# EasyEDA Pro project PicoDMX Line Driver.eprj

# Schematic Schematic1
Board Name: Line Driver; Create Date: 2025-05-27; Page Name: P1; Project Name: PicoDMX Line Driver; Schematic Name: Schematic1; Update Date: 2025-05-30; Company: Marcus Birkin; Drawn: Marcus; Page Size: A5; Version: 1
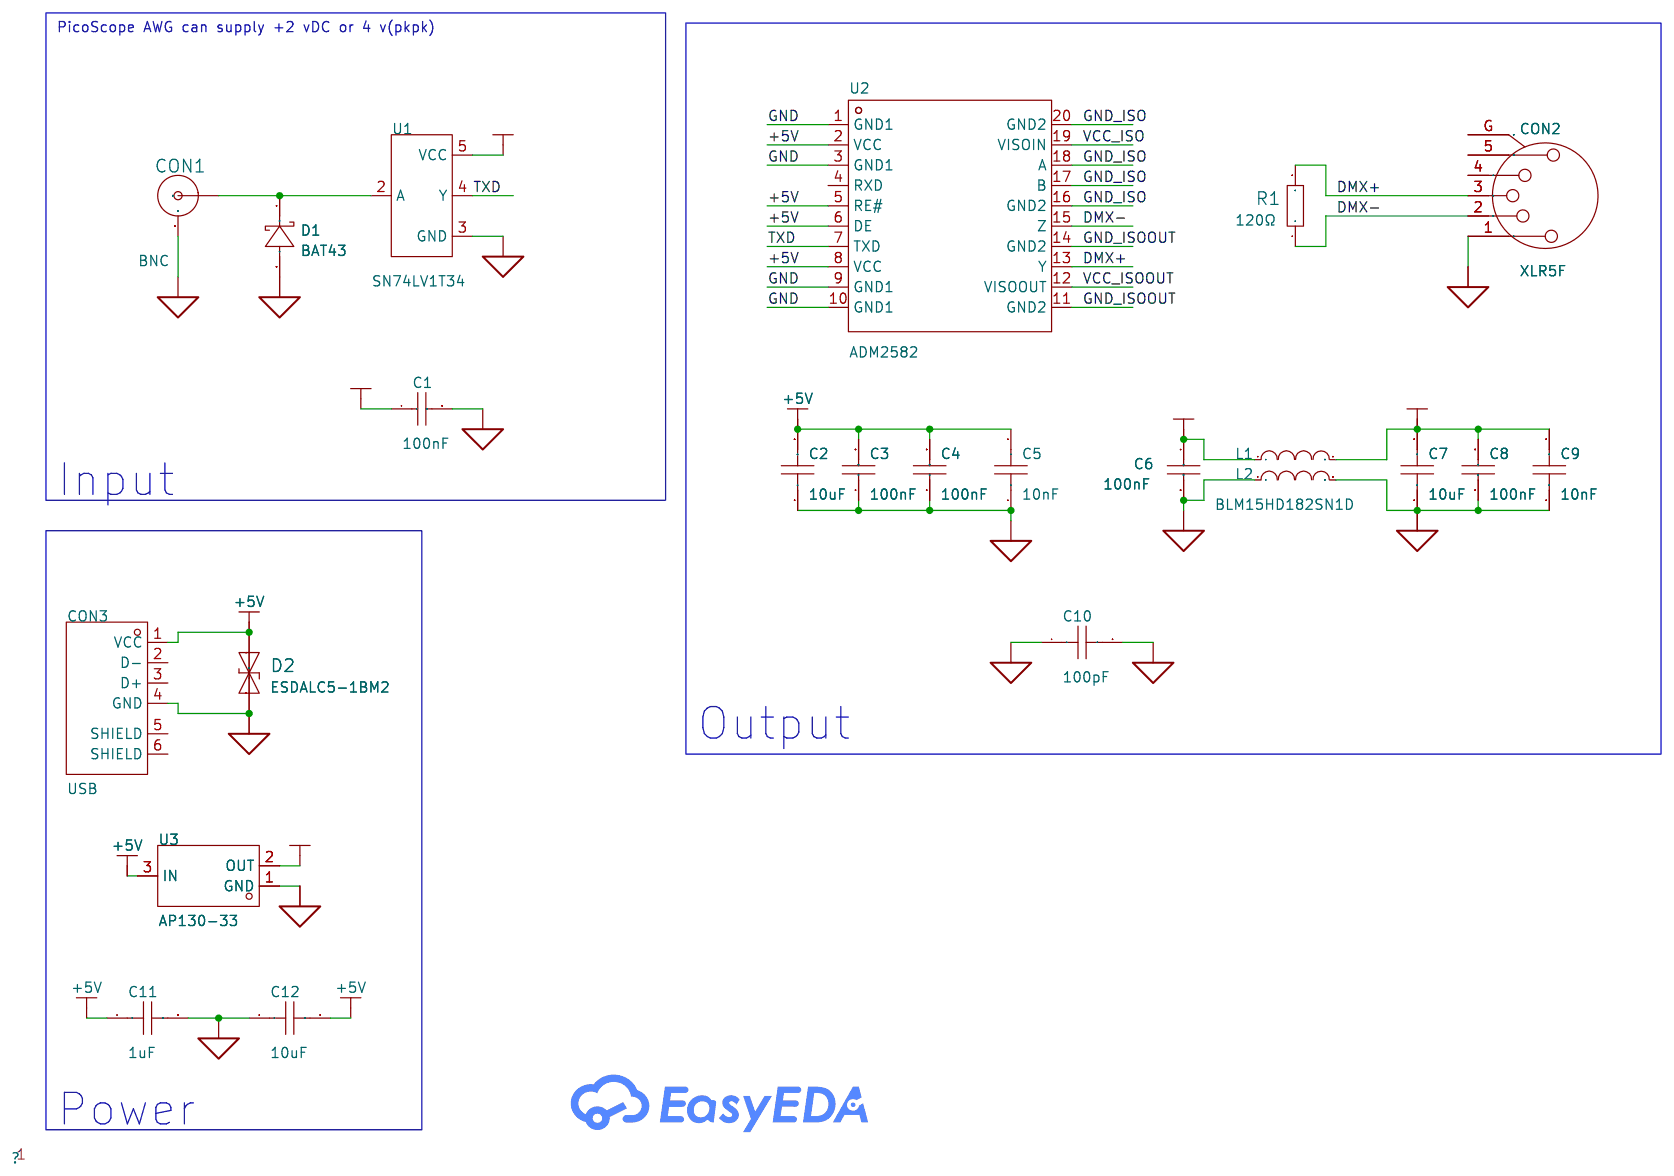
[diagram p0: schematic sheet]

## Parts
C1  100nF  [C0603]
C2  10uF  [C0805]
C3  100nF  [C0603]
C4  100nF  [C0603]
C5  10nF  [C0603]
C6  100nF  [C0603]
C7  10uF  [C0805]
C8  100nF  [C0603]
C9  10nF  [C0603]
C10  100pF  [C1812]
C11  1uF  [C0603]
C12  10uF  [C0805]
CON1  BNC  [ANT-TH_KH-BNC50-3511]
CON2  XLR5F  [CONN-TH_NC5FAH]
CON3  USB  [USB-B-TH_AMPHENOL_61729-0010BLF]
D1  BAT43  [SOD-323_L1.7-W1.3-LS2.6-RD-1]
D2  ESDALC5-1BM2  [SOD-882_L1.0-W0.6-BI-1]
L1  BLM15HD182SN1D  [L0402]
L2  BLM15HD182SN1D  [L0402]
R1  120Ω  [R0603]
U1  SN74LV1T34  [SOT-23-5_L2.9-W1.6-P0.95-LS2.8-BR]
U2  ADM2582  [SOIC-20_L13.0-W7.6-P1.27-LS10.3-BL]
U3  AP130-33  [SC-59-3_L2.9-W1.5-P0.95-LS2.5-BR]

## Library data of the parts
C1 C3 C4 C6 C8 = C0603C104K5RACTU: LCSC Part Name: 100nF ±10% 50V; Supplier Part: C127833; Manufacturer: KEMET(基美); Supplier Footprint: 0603; JLCPCB Part Class: Extended Part; Datasheet: https://atta.szlcsc.com/upload/public/pdf/source/20180326/C129691_620535B46A8EA2FB2DC0739E6AA6F36A.pdf; Supplier: LCSC; Tolerance: ±10%; Voltage Rating: 50V; Temperature Coefficient: X7R
C2 C7 C12 = C0805C106K8PACTU: LCSC Part Name: 10uF ±10% 10V; Supplier Part: C2167673; Manufacturer: KEMET(基美); Supplier Footprint: 0805; JLCPCB Part Class: Extended Part; Datasheet: https://atta.szlcsc.com/upload/public/pdf/source/20210601/F69F25D6FEA5EB3D7C122B835EA50B80.pdf; Supplier: LCSC; Tolerance: ±10%
C5 C9 = C0603C103J5RAC7867: LCSC Part Name: 10nF ±5% 50V; Supplier Part: C141070; Manufacturer: KEMET(基美); Supplier Footprint: 0603; JLCPCB Part Class: Extended Part; Datasheet: https://atta.szlcsc.com/upload/public/pdf/source/20180418/C190790_D7C76C15864DAD2D05332FBDBFF02F59.pdf; Supplier: LCSC; Tolerance: ±5%
C10 = C4532C0G3F101K160KA: LCSC Part Name: 100pF ±10% 3kV; Supplier Part: C2167913; Manufacturer: TDK; Supplier Footprint: 1812; JLCPCB Part Class: Extended Part; Datasheet: https://atta.szlcsc.com/upload/public/pdf/source/20210430/6D9A36C8C5D95BF03488684137B0D508.pdf; Supplier: LCSC; Tolerance: ±10%
C11 = C0603C105K8PAC7867: Capacitance: Tolerance:±10% Tolerance:±10% Voltage Rated: Temperature Coefficient:; LCSC Part Name: 1uF ±10% 10V; Supplier Part: C599658; Manufacturer: KEMET(基美); Supplier Footprint: 0603; JLCPCB Part Class: Extended Part; Datasheet: https://atta.szlcsc.com/upload/public/pdf/source/20200618/C599658_D69DC6DD034FFAE34545B4DB2250202B.pdf; Supplier: LCSC; Tolerance: ±10%
CON1 = KH-BNC50-3511: Connector Type:板端 Interface Type:内孔 Number of Ports:1 Interface Diameter:9.5mm Interface Length/Height:- Frequency-Max:3GHz RF Series:BNC Impedance:50Ω Style:弯头 Operating Temperature Range:-55℃~+155℃ Operating Temperature Range:-55℃~+155℃; LCSC Part Name: BNC 内孔 弯头; Supplier Part: C2837587; Manufacturer: kinghelm(金航标); Supplier Footprint: 插件; JLCPCB Part Class: Extended Part; Datasheet: https://atta.szlcsc.com/upload/public/pdf/source/20221123/AFF24A942BB0EF6B7776F494013BE75C.pdf; Supplier: LCSC; Connector Type: 板端; Interface Type: 内孔; Number of Ports: 1; Interface Diameter: 9.5mm; Frequency-Max: 3GHz; Impedance: 50Ω; Style: 弯头; Operating Temperature Range: -55℃~+155℃
CON2 = NC5FAH: Supplier Part: C368501; Manufacturer: NEUTRIK(优曲克); Supplier Footprint: 插件; JLCPCB Part Class: Extended Part; Datasheet: https://atta.szlcsc.com/upload/public/pdf/source/20191012/C368501_48BF0D1DB9A038BF0C77086A8AE98FA7.pdf; Supplier: LCSC
CON3 = 61729-1011BLF: LCSC Part Name: Type-B 母 弯插; Supplier Part: C254704; Manufacturer: Amphenol; Supplier Footprint: 插件; JLCPCB Part Class: Extended Part; Datasheet: https://atta.szlcsc.com/upload/public/pdf/source/20220215/3240002EE1DEE46B009290BA915BD368.pdf; Supplier: LCSC; Connector Type: Type-B; Standard: USB 2.0; Gender: Female; Mounting Style: Bend insert; Number of Contacts: 4P; Number of Ports: 1; Operating Temperature Range: -55℃~+85℃
D1 = BAT43WS_C7502693: LCSC Part Name: 电压:30V 电流:200mA; Supplier Part: C7502693; Manufacturer: 宏迦橙; Supplier Footprint: SOD-323; JLCPCB Part Class: Extended Part; Datasheet: https://atta.szlcsc.com/upload/public/pdf/source/20230828/C7BEF188DCC55075738098E602AF8932.pdf; Supplier: LCSC; Diode Configuration: Single; Forward Voltage (Vf@If): 1V@0.2A; Reverse Voltage (Vr): 30V; Average Rectified Current (Io): 200mA; Reverse Leakage Current (Ir): 500nA; Peak forward surge current: 4A
D2 = ESDALC5-1BM2: Supplier Part: C1974505; Manufacturer: ST(意法半导体); Supplier Footprint: SOD-882; JLCPCB Part Class: Extended Part; Datasheet: https://atta.szlcsc.com/upload/public/pdf/source/20210701/73BC0DDABB7475F0CD853E221D79507A.pdf; Supplier: LCSC; Reverse Stand-Off Voltage (Vrwm): 5V; Maximum Clamping Voltage: 5.8V; Peak Pulse Power Dissipation (Ppp)@10/1000us: 150W; Breakdown Voltage: 5.8V; Operating Temperature: -55℃~+150℃@(Tj); Type: ESD
L1 L2 = BLM15HD182SN1D: LCSC Part Name: 单路 0402磁珠 阻抗1.8kΩ@100MHz; Supplier Part: C76888; Manufacturer: muRata(村田); Supplier Footprint: 0402; JLCPCB Part Class: Extended Part; Datasheet: https://atta.szlcsc.com/upload/public/pdf/source/20180326/C88968_F3BA34B77F909E6389EF9B963D60C071.pdf; Supplier: LCSC; Impedance @ Frequency: 1.8kΩ@100MHz; Tolerance: ±25%; DC Resistance: 2.2Ω; Current Rating: 200mA; Circuits: 1
R1 = 0603WAF1200T5E: LCSC Part Name: 120Ω ±1% 100mW 厚膜电阻; Supplier Part: C22787; Manufacturer: UNI-ROYAL(厚声); Supplier Footprint: 0603; JLCPCB Part Class: Basic Part; Datasheet: https://atta.szlcsc.com/upload/public/pdf/source/20200306/C422600_1E6D84923E4A46A82E41ADD87F860B5C.pdf; Supplier: LCSC; Type: Thick Film Resistors; Tolerance: ±1%; Temperature Coefficient: ±100ppm/℃; Operating Temperature Range: -55℃~+155℃
U1 = SN74LV1T34DBVR: Input type:- output type:- Voltage - Supply:1.6V~5.5V Voltage - Supply:1.6V~5.5V Number of Elements:1 Number of Bits per Element:1 Current - Output Low(IOL):8mA Current - Output High(IOH):8mA Logic Family:74LV Operating Temperature:-40℃~+125℃ Operating Te; Supplier Part: C100024; Manufacturer: TI(德州仪器); Supplier Footprint: SOT-23-5; JLCPCB Part Class: Extended Part; Datasheet: https://www.ti.com/cn/lit/gpn/sn74lv1t34; Supplier: LCSC; Voltage - Supply: 1.6V~5.5V; Number of Elements: 1; Number of Bits per Element: 1; Current - Output Low(IOL): 8mA; Current - Output High(IOH): 8mA; Logic Family: 74LV; Operating Temperature: -40℃~+125℃
U2 = ADM2582EBRWZ-REEL7: LCSC Part Name: 2.5 kV信号和电源隔离、±15 kV ESD保护、全/半双工RS-485收发器(16Mbps); Supplier Part: C39494; Manufacturer: ADI(亚德诺); Supplier Footprint: SOIC-20-300mil; JLCPCB Part Class: Extended Part; Datasheet: https://atta.szlcsc.com/upload/public/pdf/source/20220721/6BB53C864ED93F5D36B0DC291BEFEF02.pdf; Supplier: LCSC; Communication Mode: Full-duplex；Half-Duplex; Voltage - Supply: 3.3V；5V; Isolation Voltage(Vrms): 2500; CMTI(kV/us): 25kV/us; Operating Temperature: -40℃~+85℃
U3 = AP130-33RG-7: LCSC Part Name: 300mA低压差线性稳压器; Supplier Part: C156319; Manufacturer: DIODES(美台); Supplier Footprint: SC-59R; JLCPCB Part Class: Extended Part; Datasheet: https://atta.szlcsc.com/upload/public/pdf/source/20180502/C211383_3A64D916EE20C5FB1434B0F452C39E5F.pdf; Supplier: LCSC; Output Type: Fixed; Maximum Input Voltage: 5.5V; Output Voltage: 3.3V; Output Current: 300mA; Power Supply Rejection Ratio (PSRR): 58dB@(100Hz); Dropout Voltage: 500mV@(300mA); standby current: 100uA; Feature: Thermal Protection(TSD)；Overcurrent Protection(OCP); Operating Temperature: -40℃~+85℃@(Ta); Output Polarity: Positive electrode; Number of Outputs: 1

## Nets
+3V3: C1.1 U1.5(VCC) U3.2(OUT)
+5V: C2.2 C3.2 C4.2 C5.2 C11.1 C12.2 CON3.1(VCC) D2.1(K) U2.2(VCC) U2.5(RE#) U2.6(DE) U2.8(VCC) U3.3(IN)
GND: C1.2 C2.1 C3.1 C4.1 C5.1 C10.1 C11.2 C12.1 CON1.2 CON3.4(GND) D1.2(A) D2.2(A) U1.3(GND) U2.1(GND1) U2.3(GND1) U2.9(GND1) U2.10(GND1) U3.1(GND)
GND_ISO: C7.1 C8.1 C9.1 CON2.1 L2.2 U2.16(GND2) U2.17(B) U2.18(A) U2.20(GND2)
GND_ISOOUT: C6.2 C10.2 L2.1 U2.11(GND2) U2.14(GND2)
VCC_ISO: C7.2 C8.2 C9.2 L1.2 U2.19(VISOIN)
VCC_ISOOUT: C6.1 L1.1 U2.12(VISOOUT)
DMX+: CON2.3 R1.2 U2.13(Y)
DMX-: CON2.2 R1.1 U2.15(Z)
TXD: U1.4(Y) U2.7(TXD)
$1N303: CON1.1(OUT) D1.1(K) U1.2(A)

Not connected (* = marked no-connect by the designer): CON2 4 5 G; CON3 2(D-) 3(D+) 5(SHIELD) 6(SHIELD); U2 4(RXD)

## Notes on the sheet
- PicoScope AWG can supply +2 vDC or 4 v(pkpk)
- Input
- Output
- Power

# Board PCB1
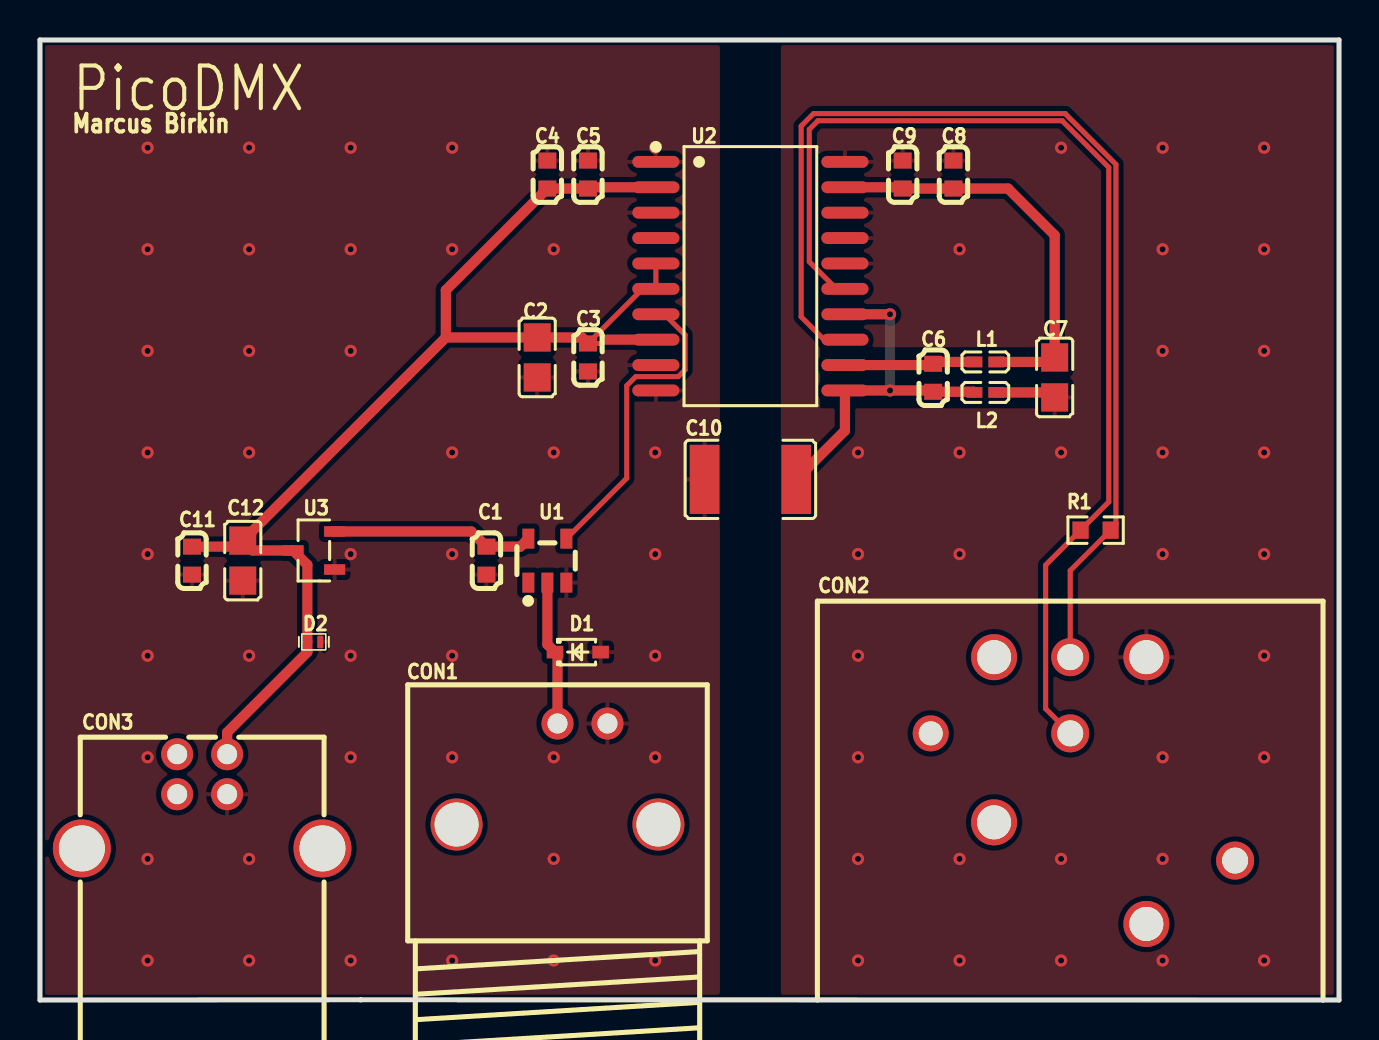
[diagram p1: board, top side]
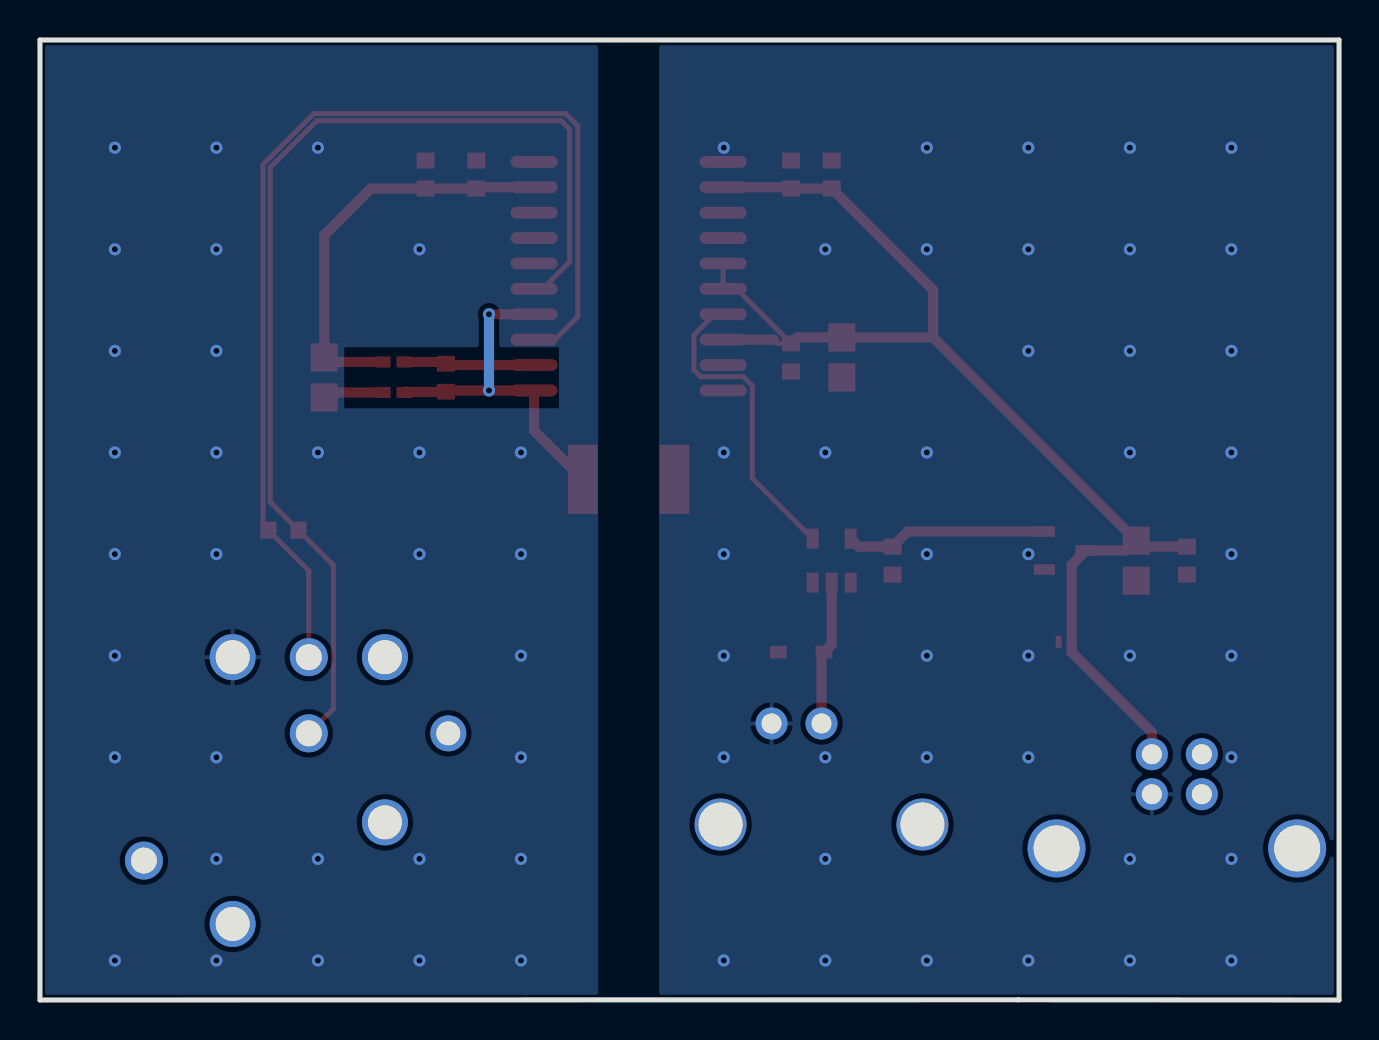
[diagram p2: board, bottom side, seen from below]

Outline 65 x 48 mm; copper layers: Top Layer, Bottom Layer. Coordinates in mm from the lower left corner of the outline.
Outline path: 0,48 0,0 16.05,0.01 65,0 65,48 0,48
Stack: Top Layer 0.035mm / Dielectric1 1.51mm FR4 er 4.5 / Bottom Layer 0.035mm

## Design rules (mm)
template: JLCPCB Capability(Two Layers Board)
spacing copperThickness1oz (default): track to track 0.102, other pairs 0.152 to 0.3
spacing copperThickness2oz: track to track 0.203, other pairs 0.152 to 0.3
track width copperThickness1oz (default): min 0.127, default 0.254, max 2.54
track width copperThickness2oz: min 0.203, default 0.254, max 2.54
differential pair differentialPair (default): width min 0.127, default 0.254, max 2.54; gap min 0.152, default 0.152
via viaSize (default): diameter min 0.5, default 0.61, max 10; hole min 0.3, default 0.305, max 6.3

## Placement (name value [footprint] x y rotation side)
C1  100nF  [C0603]  22.34 21.97 270 top
C2  10uF  [C0805]  24.88 32.13 90 top
C3  100nF  [C0603]  27.42 32.13 90 top
C4  100nF  [C0603]  25.39 41.27 270 top
C5  10nF  [C0603]  27.42 41.27 270 top
C6  100nF  [C0603]  44.69 31.11 270 top
C7  10uF  [C0805]  50.77 31.13 90 top
C8  100nF  [C0603]  45.71 41.27 270 top
C9  10nF  [C0603]  43.17 41.27 270 top
C10  100pF  [C1812]  35.55 26.03 0 top
C11  1uF  [C0603]  7.61 21.97 270 top
C12  10uF  [C0805]  10.15 21.97 90 top
CON1  BNC  [ANT-TH_KH-BNC50-3511]  25.9 11.3 0 top
CON2  XLR5F  [CONN-TH_NC5FAH]  51.55 13.33 180 top
CON3  USB  [USB-B-TH_AMPHENOL_61729-0010BLF]  8.12 9.93 0 top
D1  BAT43  [SOD-323_L1.7-W1.3-LS2.6-RD-1]  26.91 17.4 0 top
D2  ESDALC5-1BM2  [SOD-882_L1.0-W0.6-BI-1]  13.7 17.9 0 top
L1  BLM15HD182SN1D  [L0402]  47.3 31.9 0 top
L2  BLM15HD182SN1D  [L0402]  47.3 30.38 0 top
R1  120Ω  [R0603]  52.82 23.49 0 top
U1  SN74LV1T34  [SOT-23-5_L2.9-W1.6-P0.95-LS2.8-BR]  25.39 21.97 270 top
U2  ADM2582  [SOIC-20_L13.0-W7.6-P1.27-LS10.3-BL]  35.55 36.19 270 top
U3  AP130-33  [SC-59-3_L2.9-W1.5-P0.95-LS2.5-BR]  13.7 22.48 0 top

## Footprints (pads in the part's own frame, mm; a bottom-side part is the same pattern mirrored in y, then rotated)
ANT-TH_KH-BNC50-3511
  round 1.6 hole 1: 1(0,2.525) 2(2.5,2.525)
  round 2.601 hole 2.2: 3(5.05,-2.525) 4(-5.05,-2.525)
C0603
  rect 0.8x0.9 smd: 1(-0.7,0) 2(0.7,0)
C0805
  rect 1.41x1.35 smd: 1(-1,0) 2(1,0)
C1812
  rect 1.485x3.456 smd: 1(-2.292,0) 2(2.292,0)
CONN-TH_NC5FAH
  round 2.3 hole 1.7: (-3.81,9.53) (3.81,4.45) 1(-3.81,-3.81) 5(3.81,-3.81)
  round 1.9 hole 1.3: 2(0,0) 3(0,-3.81) G(-8.25,6.36)
  round 1.8 hole 1.199: 4(6.98,0)
L0402
  rect 0.79x0.54 smd: 1(-0.545,0) 2(0.545,0)
R0603
  rect 0.806x0.864 smd: 1(-0.753,0) 2(0.753,0)
SC-59-3_L2.9-W1.5-P0.95-LS2.5-BR
  rect 1.058x0.532 smd: 1(1.041,-0.95) 2(1.041,0.95) 3(-1.041,0)
SOD-323_L1.7-W1.3-LS2.6-RD-1
  rect 0.83x0.63 smd: 1(-1.14,0) 2(1.14,0)
SOD-882_L1.0-W0.6-BI-1
  rect 0.3x0.6 smd: 1(-0.325,0) 2(0.325,0)
SOIC-20_L13.0-W7.6-P1.27-LS10.3-BL
  oval 0.595x2.36 smd: 1(-5.715,-4.73) 2(-4.445,-4.73) 3(-3.175,-4.73) 4(-1.905,-4.73) 5(-0.635,-4.73) 6(0.635,-4.73) 7(1.905,-4.73) 8(3.175,-4.73) 9(4.445,-4.73) 10(5.715,-4.73) 11(5.715,4.73) 12(4.445,4.73) 13(3.175,4.73) 14(1.905,4.73) 15(0.635,4.73) 16(-0.635,4.73) 17(-1.905,4.73) 18(-3.175,4.73) 19(-4.445,4.73) 20(-5.715,4.73)
SOT-23-5_L2.9-W1.6-P0.95-LS2.8-BR
  rect 1x0.6 smd: 1(1.1,-0.95) 2(1.1,0) 3(1.1,0.95) 4(-1.1,0.95) 5(-1.1,-0.95)
USB-B-TH_AMPHENOL_61729-0010BLF
  round 1.6 hole 1: 1(1.25,2.355) 2(-1.25,2.355) 3(-1.25,0.355) 4(1.25,0.355)
  round 2.9 hole 2.3: 5(-6.02,-2.355) 6(6.02,-2.355)

## Nets
As in the schematic.

Pads without a net: CON1 3 4; CON2 4 5 G; CON3 2 3 5 6; U1 1; U2 4

## Via types
v1: diameter 0.61, hole 0.305, Top Layer to Bottom Layer, 74 vias

## Routing (per net, layer and track width the routed paths; a pad name or vN(x,y) marks a point on that pad's centre or on a via; arc(x,y) is an arc through that point)
+3V3: length 10.2
  Top Layer w0.508: U1.5 24.04,22.67 C1.1 21.58,23.43 U3.2
+5V: length 63.4
  Top Layer w0.254: U2.5 U2.6 30.15,35.56 C3.2 28.09,32.83 28.28,33.02
  Top Layer w0.508: 20.31,33.13 20.31,35.49 C4.2 C5.2 27.48,40.64 U2.2 ; 20.31,33.13 C12.2 ; 20.31,33.13 C2.2 27.12,33.13 C3.2 ; C11.1 9.85,22.67 C12.2 ; C12.2 10.64,22.48 U3.3 13.38,21.76 13.38,17.39 9.37,13.38 CON3.1 ; U2.8 28.28,33.02
GND:
  vias: v1(5.38,42.61) v1(5.38,37.53) v1(5.38,32.45) v1(5.38,27.38) v1(5.38,22.3) v1(5.38,17.22) v1(5.38,12.14) v1(5.38,7.06) v1(5.38,1.97) v1(10.47,42.61) v1(10.47,37.53) v1(10.47,32.45) v1(10.47,27.38) v1(10.47,17.22) v1(10.47,7.06) v1(10.47,1.97) v1(15.55,42.61) v1(15.55,37.53) v1(15.55,32.45) v1(15.55,22.3) v1(15.55,17.22) v1(15.55,12.14) v1(15.55,1.97) v1(20.62,42.61) v1(20.62,37.53) v1(20.62,27.38) v1(20.62,22.3) v1(20.62,17.22) v1(20.62,12.14) v1(20.62,1.97) v1(25.7,37.53) v1(25.7,27.38) v1(25.7,12.14) v1(25.7,7.06) v1(25.7,1.97) v1(30.79,42.61) v1(30.79,27.38) v1(30.79,22.3) v1(30.79,17.22) v1(30.79,12.14) v1(30.79,1.97)
GND_ISO: length 3
  Top Layer w0.508: C7.1 50.52,30.38 L2.2
  vias: v1(40.93,27.38) v1(40.93,22.3) v1(40.93,17.22) v1(40.93,12.14) v1(40.93,7.06) v1(40.93,1.97) v1(46.01,37.53) v1(46.01,27.38) v1(46.01,22.3) v1(46.01,7.06) v1(46.01,1.97) v1(51.09,42.61) v1(51.09,27.38) v1(51.09,7.06) v1(51.09,1.97) v1(56.17,42.61) v1(56.17,37.53) v1(56.17,32.45) v1(56.17,27.38) v1(56.17,22.3) v1(56.17,12.14) v1(56.17,7.06) v1(56.17,1.97) v1(61.25,42.61) v1(61.25,37.53) v1(61.25,32.45) v1(61.25,27.38) v1(61.25,22.3) v1(61.25,17.22) v1(61.25,12.14) v1(61.25,1.97)
GND_ISOOUT: length 18
  Top Layer w0.508: L2.1 46.72,30.41 C6.2 44.63,30.48 v1(42.53,30.48) U2.11 40.28,28.47 C10.2 ; 40.28,34.29 v1(42.53,34.29)
  Bottom Layer w0.508: v1(42.53,34.29) v1(42.53,30.48)
VCC_ISO: length 20.6
  Top Layer w0.508: U2.19 43.1,40.64 C9.2 C8.2 48.44,40.57 50.77,38.24 C7.2 50.55,31.9 L1.2
VCC_ISOOUT: length 6.5
  Top Layer w0.508: 40.28,31.75 44.63,31.75 ; L1.1 44.78,31.9 C6.1
DMX+: length 54.8
  Top Layer w0.254: U2.13 39.23,33.02 38.09,34.16 38.09,43.7 38.71,44.32 51.3,44.32 53.84,41.78 53.84,23.75 R1.2 51.55,21.47 CON2.3
DMX-: length 55.2
  Top Layer w0.254: U2.15 39.85,35.56 38.49,36.91 38.49,43.53 38.93,43.96 51.14,43.96 53.48,41.63 53.48,24.91 R1.1 50.32,21.75 50.32,14.56 CON2.2
TXD: length 15.8
  Top Layer w0.254: 30.82,34.29 31.25,34.29 32.28,33.26 32.28,31.51 31.94,31.17 29.81,31.17 29.36,30.72 29.36,26.09 U1.4
$1N303: length 7.3
  Top Layer w0.508: U1.2 25.39,17.78 D1.1 25.9,17.27 CON1.1

## Copper pours and planes (outline as drawn; the poured copper is in the pictures)
GND on Top Layer: 0,48 35.55,48 35.55,0 0,0
GND on Bottom Layer: 0,48 35.55,48 35.55,0 0,0
GND_ISO on Top Layer: 35.55,48 65,48 65,0 35.55,0
GND_ISO on Bottom Layer: 35.55,48 65,48 65,0 35.55,0

## Text on the board
Top Silkscreen Layer: Marcus Birkin | PicoDMX
